# Altium schematic sheet ESP32.SchDoc
size A3; SheetNumber: 12; SheetTotal: 16
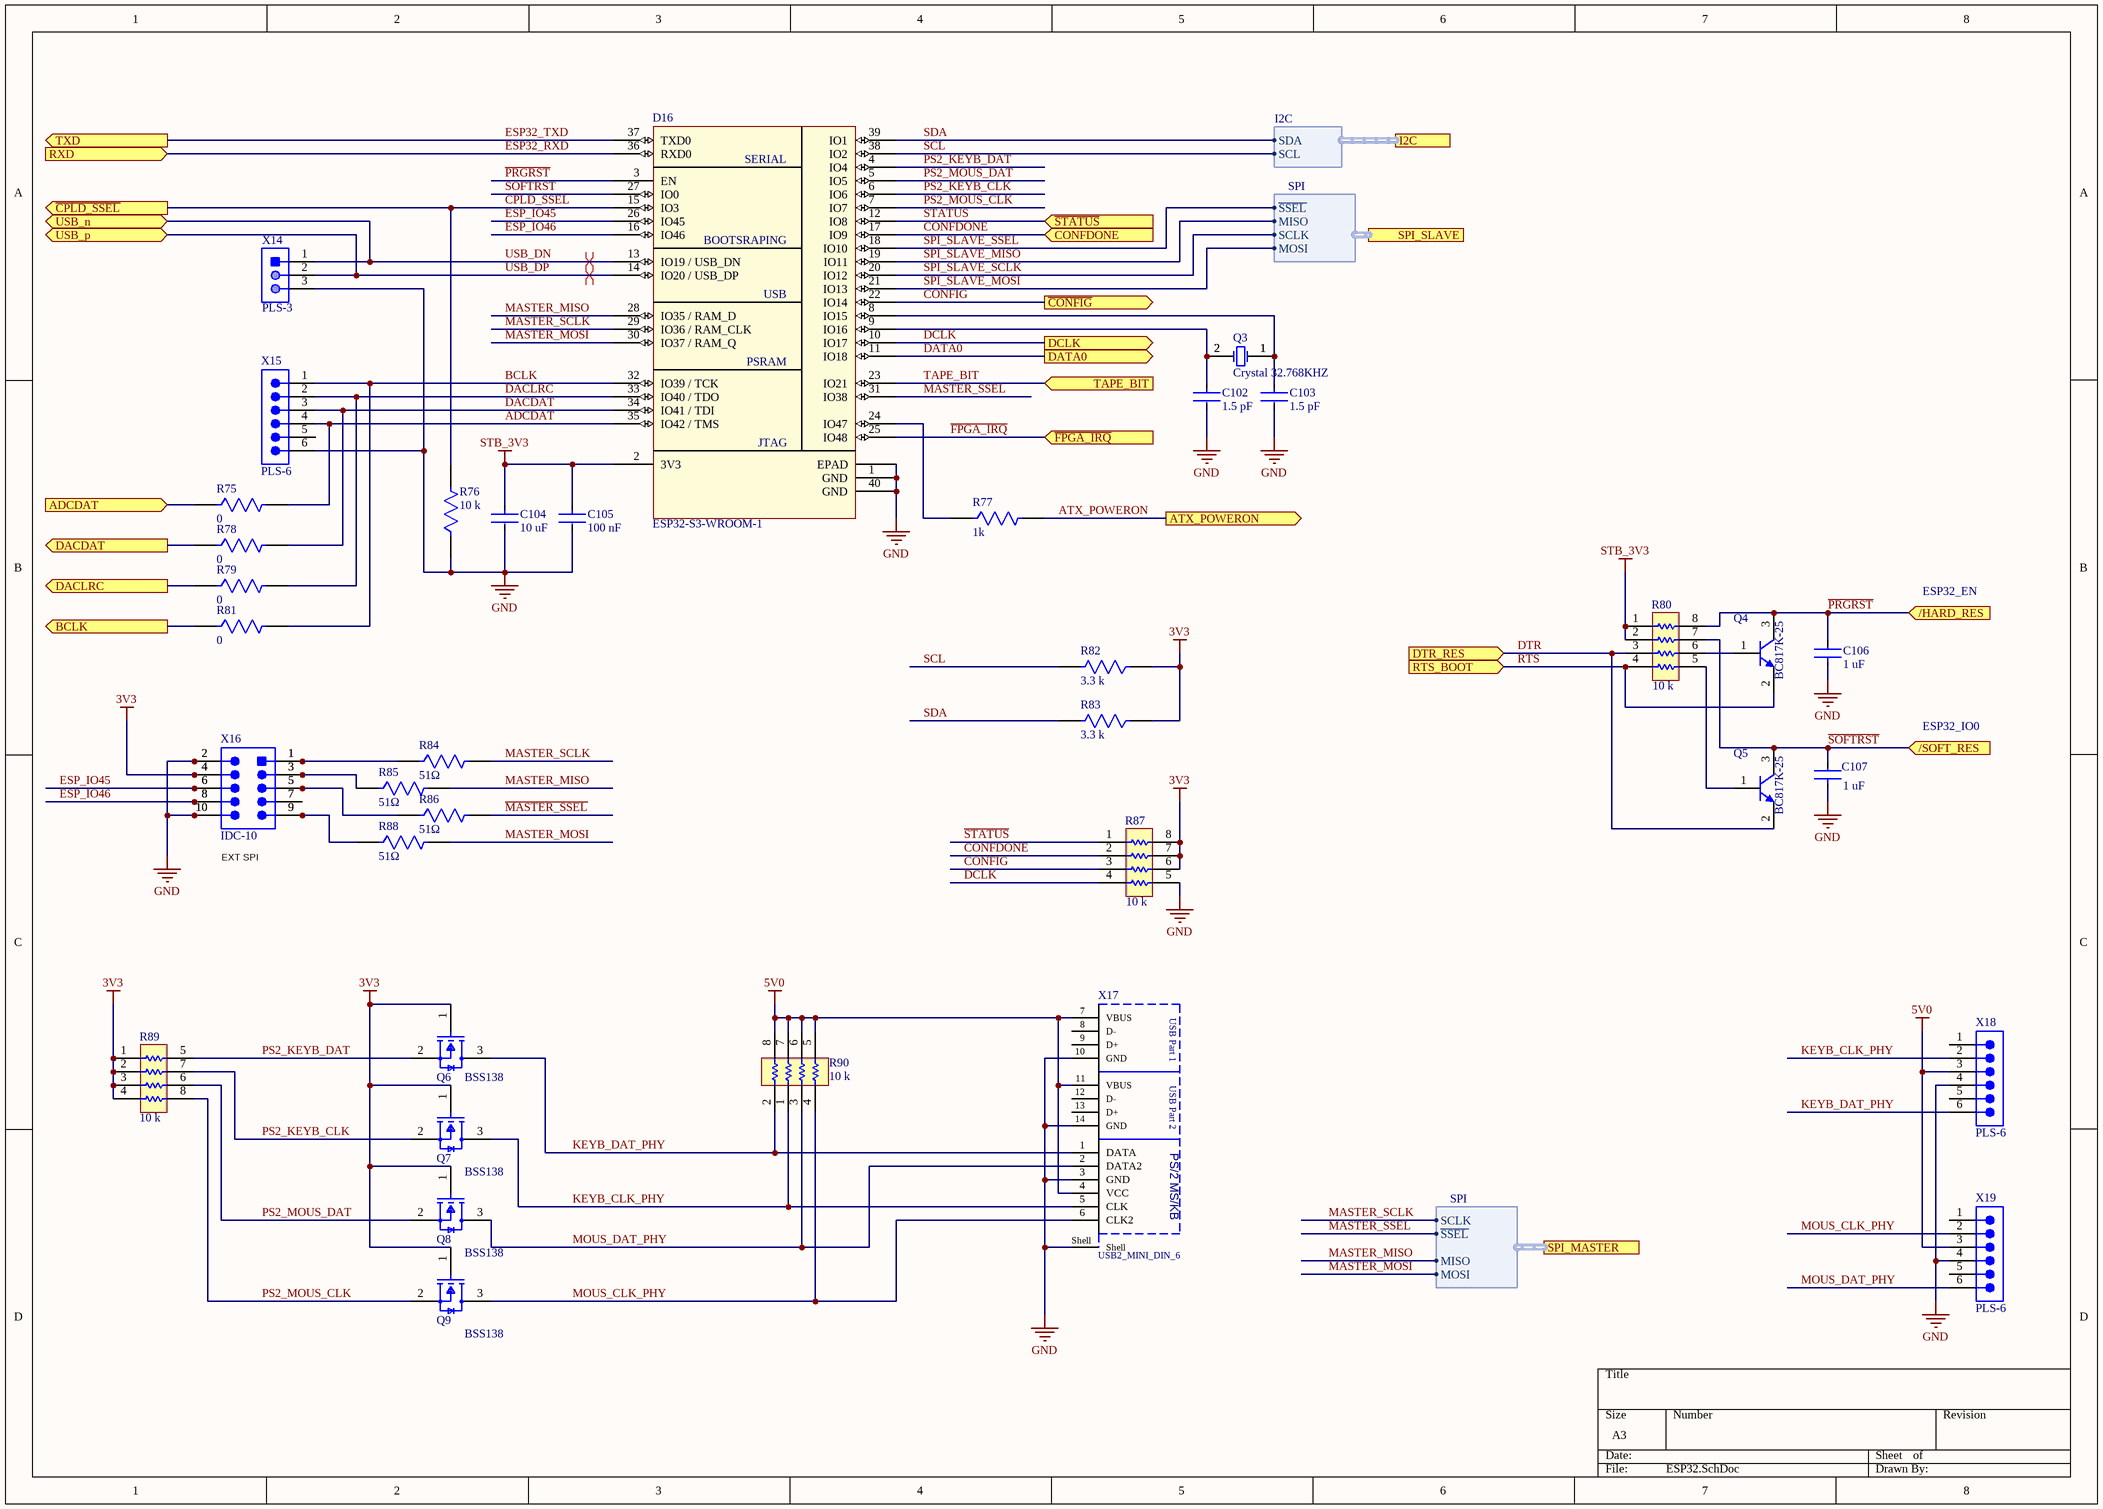
[diagram p0: ESP32.SchDoc]

## Parts
C102  Capacitance: 1.5 pF  [CC0805]  (hidden comment: CC0805-1.5pF)
C103  Capacitance: 1.5 pF  [CC0805]  (hidden comment: CC0805-1.5pF)
C104  Capacitance: 10 uF  [CC0805]  (hidden comment: CC0805-1.5pF)
C105  Capacitance: 100 nF  [CC0805]  (hidden comment: CC0805-1.5pF)
C106  Capacitance: 1 uF  [CC0805]  (hidden comment: CC0805-1.5pF)
C107  Capacitance: 1 uF  [CC0805]  (hidden comment: CC0805-1.5pF)
D16  ESP32-S3-WROOM-1  [ESP32S3WROOM1]
Q3  Crystal 32.768KHZ  [ABRA-AB15T-2_V]
Q4  BC817K-25  [SOT-23]
Q5  BC817K-25  [SOT-23]
Q6  BSS138  [SOT-23]
Q7  BSS138  [SOT-23]
Q8  BSS138  [SOT-23]
Q9  BSS138  [SOT-23]
R75  Resistance: 0  [CR0805]  (hidden comment: CR0805-51)
R76  Resistance: 10 k  [CR0805]  (hidden comment: CR0805-51)
R77  Resistance: 1k  [CR0805]  (hidden comment: CR0805-51)
R78  Resistance: 0  [CR0805]  (hidden comment: CR0805-51)
R79  Resistance: 0  [CR0805]  (hidden comment: CR0805-51)
R80  Resistance: 10 k  [BOUR-CAY16-J4_V]  (hidden comment: CAY16-103J4LF)
R81  Resistance: 0  [CR0805]  (hidden comment: CR0805-51)
R82  Resistance: 3.3 k  [CR0805]  (hidden comment: CR0805-51)
R83  Resistance: 3.3 k  [CR0805]  (hidden comment: CR0805-51)
R84  value 51Ω  [CR0805]  (hidden comment: CR0805-51)
R85  value 51Ω  [CR0805]  (hidden comment: CR0805-51)
R86  value 51Ω  [CR0805]  (hidden comment: CR0805-51)
R87  Resistance: 10 k  [BOUR-CAY16-J4_V]  (hidden comment: CAY16-103J4LF)
R88  value 51Ω  [CR0805]  (hidden comment: CR0805-51)
R89  Resistance: 10 k  [BOUR-CAY16-J4_V]  (hidden comment: CAY16-103J4LF)
R90  Resistance: 10 k  [BOUR-CAY16-J4_V]  (hidden comment: CAY16-103J4LF)
X14  PLS-3  [MOLX-22-28-4033_V]
X15  PLS-6  [SMTC-TSW-106-07-X-S]
X16  IDC-10  [BH-10]
X17  USB2_MINI_DIN_6  [USB2_MINI_DIN_6 (USB Only)]
X18  PLS-6  [SMTC-TSW-106-07-X-S]
X19  PLS-6  [SMTC-TSW-106-07-X-S]

## Ports
/HARD_RES (in), /SOFT_RES (in), ADCDAT (in), ATX_POWERON (out), BCLK (out), CONFDONE (in), DACDAT (out), DACLRC (out), DATA0 (out), DCLK (out), DTR_RES (in), I2C (harness I2C), RTS_BOOT (in), RXD (in), SPI_MASTER (harness SPI), SPI_SLAVE (harness SPI), TAPE_BIT (in), TXD (out), USB_n (bidir), USB_p (bidir), ~{CONFIG} (out), ~{CPLD_SSEL} (out), ~{FPGA_IRQ} (in), ~{STATUS} (in)

## Harnesses
SPI: ~{SSEL}, SCLK, MOSI, MISO
I2C: SDA, SCL

## Nets
3V3: Q6.1(G) Q7.1(G) Q8.1(G) Q9.1(G) R82.1 R83.1 R87.6 R87.7 R87.8 R89.1 R89.2 R89.3 R89.4 X16.4
5V0: R90.5 R90.6 R90.7 R90.8 X17.4(VCC) X17.7(VBUS) X17.11(VBUS) X18.3 X19.3
GND: C102.2 C103.2 C104.2 C105.2 C106.1 C107.1 D16.1(GND) D16.40(GND) D16.EPAD R76.1 R87.5 X14.3 X15.6 X16.2 X16.10 X17.3(GND) X17.10(GND) X17.14(GND) X17.Shell X18.4 X19.4
STB_3V3: C104.1 C105.1 D16.2(3V3) R80.1 R80.2
ADCDAT: D16.35(IO42_/_TMS) R75.2 X15.4
ADCDAT: R75.1 ; port ADCDAT  [a separate net that carries the same name]
ATX_POWERON: R77.2 ; port ATX_POWERON
BCLK: D16.32(IO39_/_TCK) R81.2 X15.1
BCLK: R81.1 ; port BCLK  [a separate net that carries the same name]
~{CONFIG}: D16.22(IO14) R87.3 ; port ~{CONFIG}
~{CPLD_SSEL}: D16.15(IO3) R76.2 ; port ~{CPLD_SSEL}
CONFDONE: D16.17(IO9) R87.2 ; port CONFDONE
DACDAT: D16.34(IO41_/_TDI) R78.2 X15.3
DACDAT: R78.1 ; port DACDAT  [a separate net that carries the same name]
DACLRC: D16.33(IO40_/_TDO) R79.2 X15.2
DACLRC: R79.1 ; port DACLRC  [a separate net that carries the same name]
DATA0: D16.11(IO18) ; port DATA0
DCLK: D16.10(IO17) R87.4 ; port DCLK
DTR: Q5.2(E) R80.3 ; port DTR_RES
ESP32_RXD: D16.36(RXD0) ; port RXD
ESP32_TXD: D16.37(TXD0) ; port TXD
ESP_IO45: D16.26(IO45) X16.6
ESP_IO46: D16.16(IO46) X16.8
~{FPGA_IRQ}: D16.25(IO48) ; port ~{FPGA_IRQ}
KEYB_CLK_PHY: Q7.3(D) R90.1 X17.5(CLK) X18.2
KEYB_DAT_PHY: Q6.3(D) R90.2 X17.1(DATA) X18.6
~{MASTER_SSEL}: D16.31(IO38) R86.2 ; port SPI_MASTER.~{SSEL}
MASTER_MISO: D16.28(IO35_/_RAM_D) R85.2 ; port SPI_MASTER.MISO
MASTER_MOSI: D16.30(IO37_/_RAM_Q) R88.2 ; port SPI_MASTER.MOSI
MASTER_SCLK: D16.29(IO36_/_RAM_CLK) R84.2 ; port SPI_MASTER.SCLK
MOUS_CLK_PHY: Q9.3(D) R90.4 X17.6(CLK2) X19.2
MOUS_DAT_PHY: Q8.3(D) R90.3 X17.2(DATA2) X19.6
~{PRGRST}: C106.2 D16.3(EN) Q4.3(C) R80.8 ; port /HARD_RES
PS2_KEYB_CLK: D16.6(IO6) Q7.2(S) R89.7
PS2_KEYB_DAT: D16.4(IO4) Q6.2(S) R89.5
PS2_MOUS_CLK: D16.7(IO7) Q9.2(S) R89.8
PS2_MOUS_DAT: D16.5(IO5) Q8.2(S) R89.6
RTS: Q4.2(E) R80.4 ; port RTS_BOOT
~{SOFTRST}: C107.2 D16.27(IO0) Q5.3(C) R80.7 ; port /SOFT_RES
~{SPI_SLAVE_SSEL}: D16.18(IO10) ; port SPI_SLAVE.~{SSEL}
~{STATUS}: D16.12(IO8) R87.1 ; port ~{STATUS}
SCL: D16.38(IO2) R82.2 ; port I2C.SCL
SDA: D16.39(IO1) R83.2 ; port I2C.SDA
SPI_SLAVE_MISO: D16.19(IO11) ; port SPI_SLAVE.MISO
SPI_SLAVE_MOSI: D16.21(IO13) ; port SPI_SLAVE.MOSI
SPI_SLAVE_SCLK: D16.20(IO12) ; port SPI_SLAVE.SCLK
TAPE_BIT: D16.23(IO21) ; port TAPE_BIT
USB_DN: D16.13(IO19_/_USB_DN) X14.1 ; port USB_n
USB_DP: D16.14(IO20_/_USB_DP) X14.2 ; port USB_p
NetC102_1: C102.1 D16.9(IO16) Q3.2(X2)
NetC103_1: C103.1 D16.8(IO15) Q3.1(X1)
NetD16_24: D16.24(IO47) R77.1
NetQ4_1: Q4.1(B) R80.6
NetQ5_1: Q5.1(B) R80.5
NetR84_1: R84.1 X16.1
NetR85_1: R85.1 X16.3
NetR86_1: R86.1 X16.5
NetR88_1: R88.1 X16.9

Not connected (* = marked no-connect by the designer): X15 5; X16 7; X17 8(D-) 9(D+) 12(D-) 13(D+); X18 1 5; X19 1 5

## Layout directives
differential pair: USB_DN, USB_DP

## Notes on the sheet
- ESP32_EN
- ESP32_IO0
- (near X16) EXT SPI
- (in symbol ESP32-S3-WROOM-1) SERIAL; BOOTSRAPING; USB; PSRAM; JTAG
- (in symbol USB2_MINI_DIN_6) USB Part 1; USB Part 2; PS/2 MS/KB

## Library data of the parts
C102 C103 C106 C107 = CC0805: CL21 Series 0805 1.5pF 50V ±0.25pF Tolerance C0G Multilayer Ceramic Chip Capacitor; Manufacturer: Samsung; Manufacturer Part Number: CL21C1R5CBANNNC; Case/Package: 0805; value: 1.5pF; Category: Cap
C104 C105 = CC0805: CL21 Series 0805 1.5pF 50V ±0.25pF Tolerance C0G Multilayer Ceramic Chip Capacitor; Manufacturer Part Number: CL21C1R5CBANNNC; Manufacturer: Samsung; value: 1.5pF; Category: Cap; Case/Package: 0805
D16 = ESP32-S3-WROOM-1: 2.4 GHz Wi­Fi (802.11 b/g/n) and Bluetooth® 5 (LE) module / Built around ESP32­S3 series of SoCs, Xtensa® dual­core 32­bit LX7 microprocessor / Flash up to 16 MB, PSRAM up to 8 MB / 36 GPIOs, rich set of peripherals / Onboard PCB antenna or external antenna connector; value: ESP32-S3-WROOM-1; Case/Package: ESP32-S3; Category: IC
Q3 = Crystal 32.768KHZ: Low Frequency Cylindrical Watch Crystal, 32.768 kHz, -20 to 70 degC, 2-Pin 5 x 1.4 x 1.5 mm THD, RoHS, Bulk; PartNumber: AB15T-32.768KHZ; Manufacturer: Abracon; value: AB15T-32.768KHZ; PackageDescription: 2-Pin THD, Body 5 x 1.4 mm, Pin Spacing 0.45 mm; Manufacturer Part Number: AB15T-32.768KHZ; Category: CrystalsandOscillators
Q4 Q5 = BC817K-25: NPN Silicon AF Transistor, 45 V VCEO, 500 mA IC, SOT23, Reel, Green; Manufacturer: Infineon; PackageDescription: 3-Pin Small Outline Transistor Package, 1.3 x 2.9 mm Body, 0.95 mm Pitch; PartNumber: BC817K-25; Manufacturer Part Number: BC817K-25; value: BC817K-25; Case/Package: SOT-23; Category: Transistor
Q6-Q9 = BSS138: MOSFET N-CH 50V 220MA SOT-23; Manufacturer: ON Semiconductor / Fairchild; Number of Pins: 3; Case/Package: SOT-23; Termination: SMD/SMT; Manufacturer Part Number: BSS138; value: BSS138; Category: Transistor
R75-R79 R81 = CR0805: 51Ω ±0.5% 0.1W 1/10W Chip Resistor 0805 (2012 Metric) Thin Film; Manufacturer: Susumu; Manufacturer Part Number: RR1220Q-510-D; Case/Package: 0805; Number of Pins: 2; Termination: SMD/SMT; value: 51Ω; Category: Res; Number of Terminations: 2
R80 R87 R89 R90 = CMP-1747-00005-1: Chip Resistor Array, 10 KOhm, +/- 5%, 62.5 mW, -55 to 125 degC, 8-Pin SMD, RoHS, Tape and Reel; Power Rating: 100 mW; Case\Package: 0603; Voltage Rating: 75 V; Tolerance: 1%; Packaging: Tape and Reel; Min Operating Temperature: -55 degC; Pins: 2; Radiation Hardening: No; DatasheetVersion: Jan-15; Length: 0.063 inch; RoHSCompliant: true; Mount: Surface Mount; ComponentLink1Description: Manufacturer URL; ComponentLink1URL: http://www.bourns.com/; Weight: 7.1E-05 oz; ComponentLink2URL: http://www.bourns.com/docs/Product-Datasheets/CATCAY.pdf; PackageReference: CAY16-J4; Width: 0.031 inch; Case Code (Imperial): 0603; Case Code (Metric): 1608; REACH SVHC: Yes; Max Operating Temperature: 155 degC; ComponentLink2Description: Datasheet; Height: 0.022 inch; PackageDescription: 8-Pin Surface Mount Device, Body 1.6 x 3.2 mm, Pitch 0.8 mm
R82 R83 = CR0805: 51Ω ±0.5% 0.1W 1/10W Chip Resistor 0805 (2012 Metric) Thin Film; Manufacturer Part Number: RR1220Q-510-D; Manufacturer: Susumu; value: 51Ω; Category: Res; Case/Package: 0805; Number of Terminations: 2; Termination: SMD/SMT; Number of Pins: 2
R84-R86 R88 = CR0805: 51Ω ±0.5% 0.1W 1/10W Chip Resistor 0805 (2012 Metric) Thin Film; Manufacturer: Susumu; Manufacturer Part Number: RR1220Q-510-D; Resistance: 680; Category: Res; Case/Package: 0805; Number of Terminations: 2; Termination: SMD/SMT; Number of Pins: 2
X14 = PLS-3: Male Header, Pitch 2.54 mm, 1 x 3 Position, Height 8.38 mm, Tail Length 3.18 mm, RoHS, Bulk; Manufacturer: Molex; value: header 3 pin, 2.54mm; PackageDescription: Male Header, Pitch 2.54 mm, 1 x 3 Position, Height 8.38 mm, Tail Length 3.18 mm; Manufacturer Part Number: 22-28-4033; Case/Package: PLS-3; Category: Connector
X15 X18 X19 = CMP-1024-00383-1: 0.025" SQ Post Header, Through-hole, Vertical, -55 to 125 degC, 2.54 mm Pitch, 6-Pin, Male, RoHS; Manufacturer: Samtec; PartNumber: TSW-106-07-G-S; Pitch: 2.54 mm; value: 6 pin header 2.54mm; PackageDescription: .025[0.64] SQ. Post Terminal Strip Assembly; Manufacturer Part Number: TSW-106-07-G-S; Case/Package: PLS-6; Category: Connector
X16 = IDC-10: Male Header, Pitch 2.54 mm, 2 x 5 Postion, Height 9.91 mm, Tail Length 2.84 mm, -55 to 105 degC, RoHS, Bulk; PartNumber: N2510; Manufacturer: 3M; Manufacturer Part Number: N2510-6002RB; Pitch: 2.54mm; value: 10-Pin Shrouded Header, 2.54mm; Case/Package: IDC-10; Category: Connector
X17 = USB2_MINI_DIN_6: USB 2.0 Type A Receptacle WR-COM, Mini DIN 6 Stacked Horizontal, THT; Part Number: 61400826021; Manufacturer: Wurth Electronics; Contact Resistance: 20mOhm; Rated Current: 1.5A; Working Voltage: 30VAC; Connector Type: USB2.0TypeA; Packaging: Tray; Package Reference: 61400826021; Mounting Technology: THT; Datasheet URL: https://katalog.we-online.de/em/datasheet/61400826021.pdf; Operating Temperature: -40to105degC; Gender: Receptacle; Orientation: StackedHorizontal; Publisher: WurthElektronik; Manufacturer URL: http://www.we-online.de; Manufacturer Part Number: 61400826021